# EAGLE schematic Etch_a_Sketch_Front (EAGLE 9.6.2)
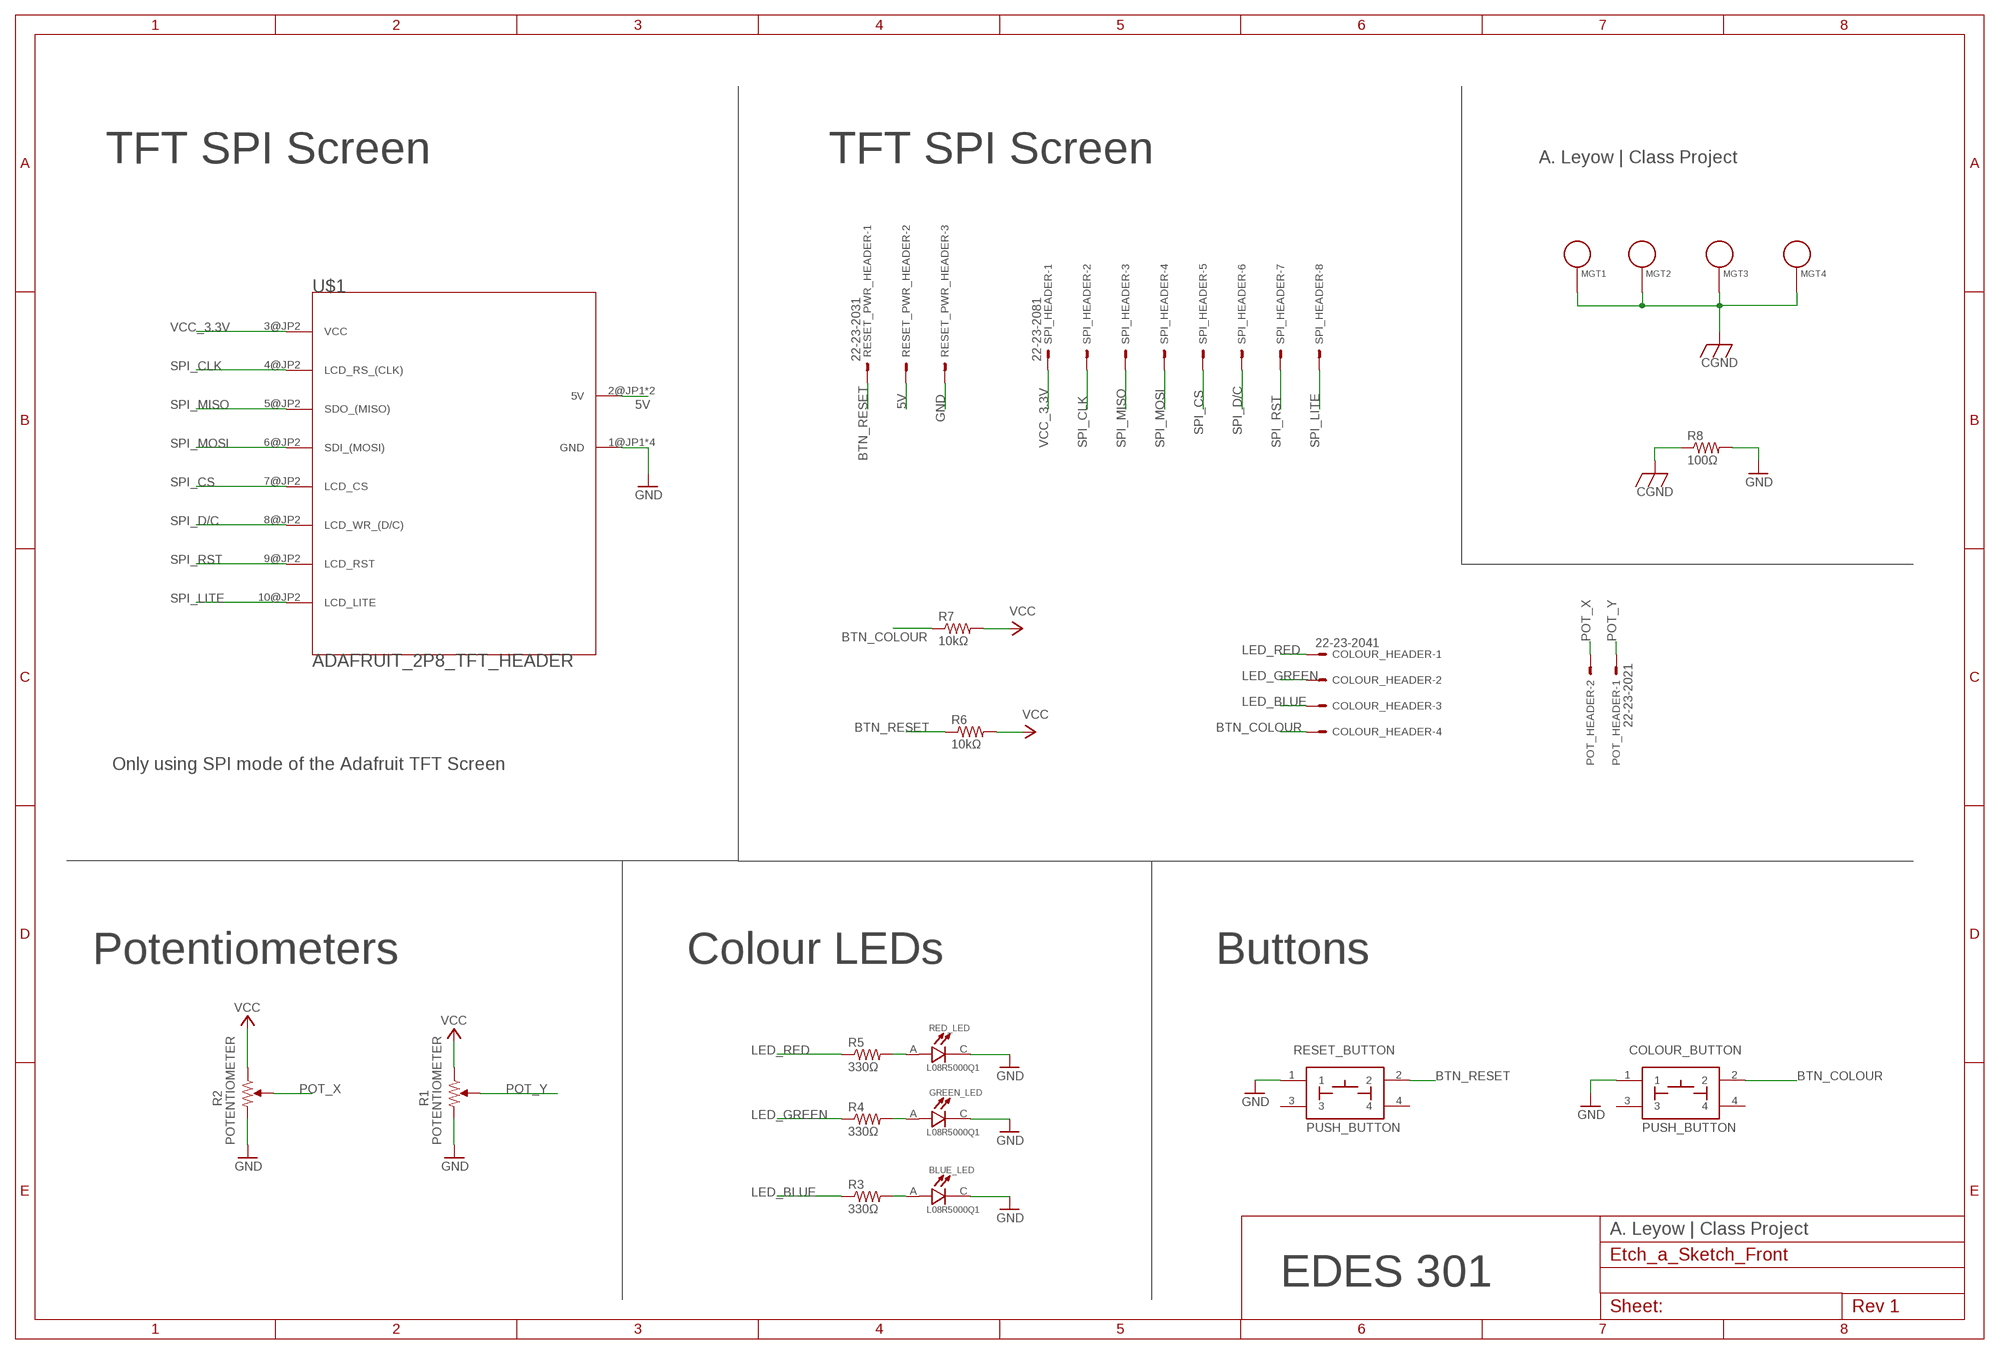
[diagram p0: schematic, sheet 1]

## Parts
BLUE_LED  L08R5000Q1  [LEDRD254W57D500H1070]
COLOUR_BUTTON  PUSH_BUTTON  [BUTTON_12.5MM]
COLOUR_HEADER  22-23-2041  [22-23-2041]
GREEN_LED  L08R5000Q1  [LEDRD254W57D500H1070]
MGT1  MOUNTING_HOLE  [MOUNTING_HOLE]
MGT2  MOUNTING_HOLE  [MOUNTING_HOLE]
MGT3  MOUNTING_HOLE  [MOUNTING_HOLE]
MGT4  MOUNTING_HOLE  [MOUNTING_HOLE]
POT_HEADER  22-23-2021  [22-23-2021]
R1  POTENTIOMETER  [POT-PO90S]
R2  POTENTIOMETER  [POT-PO90S]
R3  330Ω  R-US_R0805  [R0805]
R4  330Ω  R-US_R0805  [R0805]
R5  330Ω  R-US_R0805  [R0805]
R6  10kΩ  R-US_R0805  [R0805]
R7  10kΩ  R-US_R0805  [R0805]
R8  100Ω  R-US_R0805  [R0805]
RED_LED  L08R5000Q1  [LEDRD254W57D500H1070]
RESET_BUTTON  PUSH_BUTTON  [BUTTON_12.5MM]
RESET_PWR_HEADER  22-23-2031  [22-23-2031]
SPI_HEADER  22-23-2081  [22-23-2081]
U$1  ADAFRUIT_2P8_TFT_HEADER  [ADAFRUIT_2P8_TFT_HEADER]

## Nets
5V: RESET_PWR_HEADER.2 U$1.2@JP1(5V) U$1.2@JP2(5V)
BTN_COLOUR: COLOUR_BUTTON.2 COLOUR_HEADER.4 R7.1
BTN_RESET: R6.1 RESET_BUTTON.2 RESET_PWR_HEADER.1
CGND: MGT1.P$1 MGT2.P$1 MGT3.P$1 MGT4.P$1 R8.1
GND [GND]: BLUE_LED.C COLOUR_BUTTON.1 GREEN_LED.C R1.CW R2.CW R8.2 RED_LED.C RESET_BUTTON.1 RESET_PWR_HEADER.3 U$1.1@JP1(GND) U$1.1@JP2(GND) U$1.11@JP2(GND) U$1.12@JP1(GND)
LED_BLUE: COLOUR_HEADER.3 R3.1
LED_GREEN: COLOUR_HEADER.2 R4.1
LED_RED: COLOUR_HEADER.1 R5.1
N$1: BLUE_LED.A R3.2
N$2: GREEN_LED.A R4.2
N$3: R5.2 RED_LED.A
POT_X: POT_HEADER.2 R2.S
POT_Y: POT_HEADER.1 R1.S
SPI_CLK: SPI_HEADER.2 U$1.4@JP2(LCD_RS_(CLK))
SPI_CS: SPI_HEADER.5 U$1.7@JP2(LCD_CS)
SPI_D/C: SPI_HEADER.6 U$1.8@JP2(LCD_WR_(D/C))
SPI_LITE: SPI_HEADER.8 U$1.10@JP2(LCD_LITE)
SPI_MISO: SPI_HEADER.3 U$1.5@JP2(SDO_(MISO))
SPI_MOSI: SPI_HEADER.4 U$1.6@JP2(SDI_(MOSI))
SPI_RST: SPI_HEADER.7 U$1.9@JP2(LCD_RST)
VCC [VCC]: R1.CCW R2.CCW R6.2 R7.2
VCC_3.3V: SPI_HEADER.1 U$1.3@JP2(VCC)
Unconnected: COLOUR_BUTTON.3 COLOUR_BUTTON.4 RESET_BUTTON.3 RESET_BUTTON.4

## Notes on the sheet
- TFT SPI Screen | TFT SPI Screen | A. Leyow | Class Project
- Only using SPI mode of the Adafruit TFT Screen
- Potentiometers | Colour LEDs | Buttons
- A. Leyow | Class Project
- EDES 301

## Library data of the parts
BLUE_LED GREEN_LED RED_LED = L08R5000Q1:L08R5000Q1: Check availability <https://pricing.snapeda.com/parts/L08R5000Q1/LED%20Technology/view-part?ref=eda>; AVAILABILITY: In Stock; CHECK_PRICES: https://www.snapeda.com/parts/L08R5000Q1/LED+Technology/view-part/?ref=eda; DESCRIPTION: LED, 5MM, ORANGE; LED / Lamp Size: 5mm / T-1 3/4; LED Colour: Orange; Typ Luminous Intensity: 4.3mcd; Viewing Angle: ...; MF: LED Technology; MP: L08R5000Q1; PACKAGE: None; PRICE: None; SNAPEDA_LINK: https://www.snapeda.com/parts/L08R5000Q1/LED+Technology/view-part/?ref=snap
COLOUR_BUTTON RESET_BUTTON = MISC:PUSH_BUTTON
COLOUR_HEADER = con-molex:22-23-2041: .100" (2.54mm) Center Header - 4 Pin; MF: MOLEX; MPN: 22-23-2041; OC_FARNELL: 1462920; OC_NEWARK: 38C0355
MGT1-MGT4 = MISC:MOUNTING_HOLE: Chassis Mounting Hole w/GND connection ability
POT_HEADER = con-molex:22-23-2021: .100" (2.54mm) Center Header - 2 Pin; MF: MOLEX; MPN: 22-23-2021; OC_FARNELL: 1462926; OC_NEWARK: 25C3832
R1 R2 = MISC:POTENTIOMETER: Potentiometer - Examples: P090S-14T20BR10K (987-1277-ND)
R3-R8 = rcl:R-US_: RESISTOR, American symbol; SPICEPREFIX: R
RESET_PWR_HEADER = con-molex:22-23-2031: .100" (2.54mm) Center Header - 3 Pin; MF: MOLEX; MPN: 22-23-2031; OC_FARNELL: 1462950; OC_NEWARK: 30C0862
SPI_HEADER = con-molex:22-23-2081: .100" (2.54mm) Center Header - 8 Pin; MF: MOLEX; MPN: 22-23-2081; OC_FARNELL: 1756826; OC_NEWARK: 01C7592
U$1 = Etch_a_Sketch:ADAFRUIT_2P8_TFT_HEADER: Adafruit 2.8" and 3.2" Color TFT Touchscreen Breakout v2 | HEADERS - SPI Mode - https://learn.adafruit.com/adafruit-2-8-and-3-2-color-tft-touchscreen-breakout-v2/pinouts

## Net classes
0 Signal: width 0.381 mm, drill 0.305 mm, clearance 0.381 mm
1 GND: width 0.381 mm, drill 0.305 mm, clearance 0.381 mm
2 VCC: width 0.381 mm, drill 0.305 mm, clearance 0.381 mm